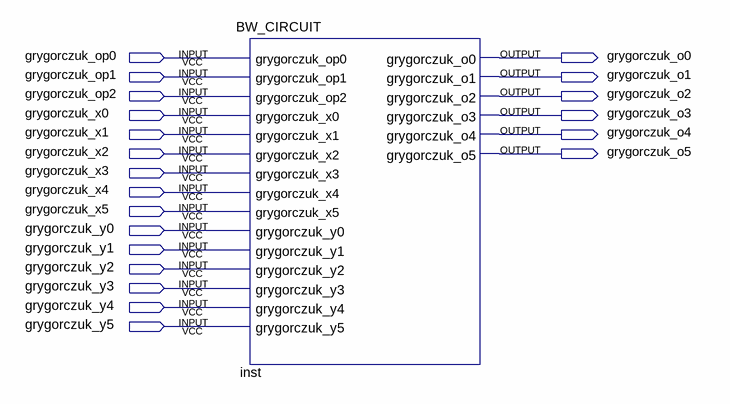
[diagram p0: schematic sheet]
// Quartus schematic BIT_WISE_OPERATIONS.bdf as structural Verilog: 1 symbols, 21 pins
module BIT_WISE_OPERATIONS (
  input  grygorczuk_op0,
  input  grygorczuk_op1,
  input  grygorczuk_op2,
  input  grygorczuk_x0,
  input  grygorczuk_x1,
  input  grygorczuk_x2,
  input  grygorczuk_x3,
  input  grygorczuk_x4,
  input  grygorczuk_x5,
  input  grygorczuk_y0,
  input  grygorczuk_y1,
  input  grygorczuk_y2,
  input  grygorczuk_y3,
  input  grygorczuk_y4,
  input  grygorczuk_y5,
  output grygorczuk_o0,
  output grygorczuk_o1,
  output grygorczuk_o2,
  output grygorczuk_o3,
  output grygorczuk_o4,
  output grygorczuk_o5
);

  BW_CIRCUIT inst (
    .grygorczuk_op0(grygorczuk_op0), .grygorczuk_op1(grygorczuk_op1), .grygorczuk_op2(grygorczuk_op2),
    .grygorczuk_x0(grygorczuk_x0), .grygorczuk_x1(grygorczuk_x1), .grygorczuk_x2(grygorczuk_x2),
    .grygorczuk_x3(grygorczuk_x3), .grygorczuk_x4(grygorczuk_x4), .grygorczuk_x5(grygorczuk_x5),
    .grygorczuk_y0(grygorczuk_y0), .grygorczuk_y1(grygorczuk_y1), .grygorczuk_y2(grygorczuk_y2),
    .grygorczuk_y3(grygorczuk_y3), .grygorczuk_y4(grygorczuk_y4), .grygorczuk_y5(grygorczuk_y5),
    .grygorczuk_o0(grygorczuk_o0), .grygorczuk_o1(grygorczuk_o1), .grygorczuk_o2(grygorczuk_o2),
    .grygorczuk_o3(grygorczuk_o3), .grygorczuk_o4(grygorczuk_o4), .grygorczuk_o5(grygorczuk_o5));
endmodule
